# Altium schematic sheet LCD Cape.SchDoc
size A4
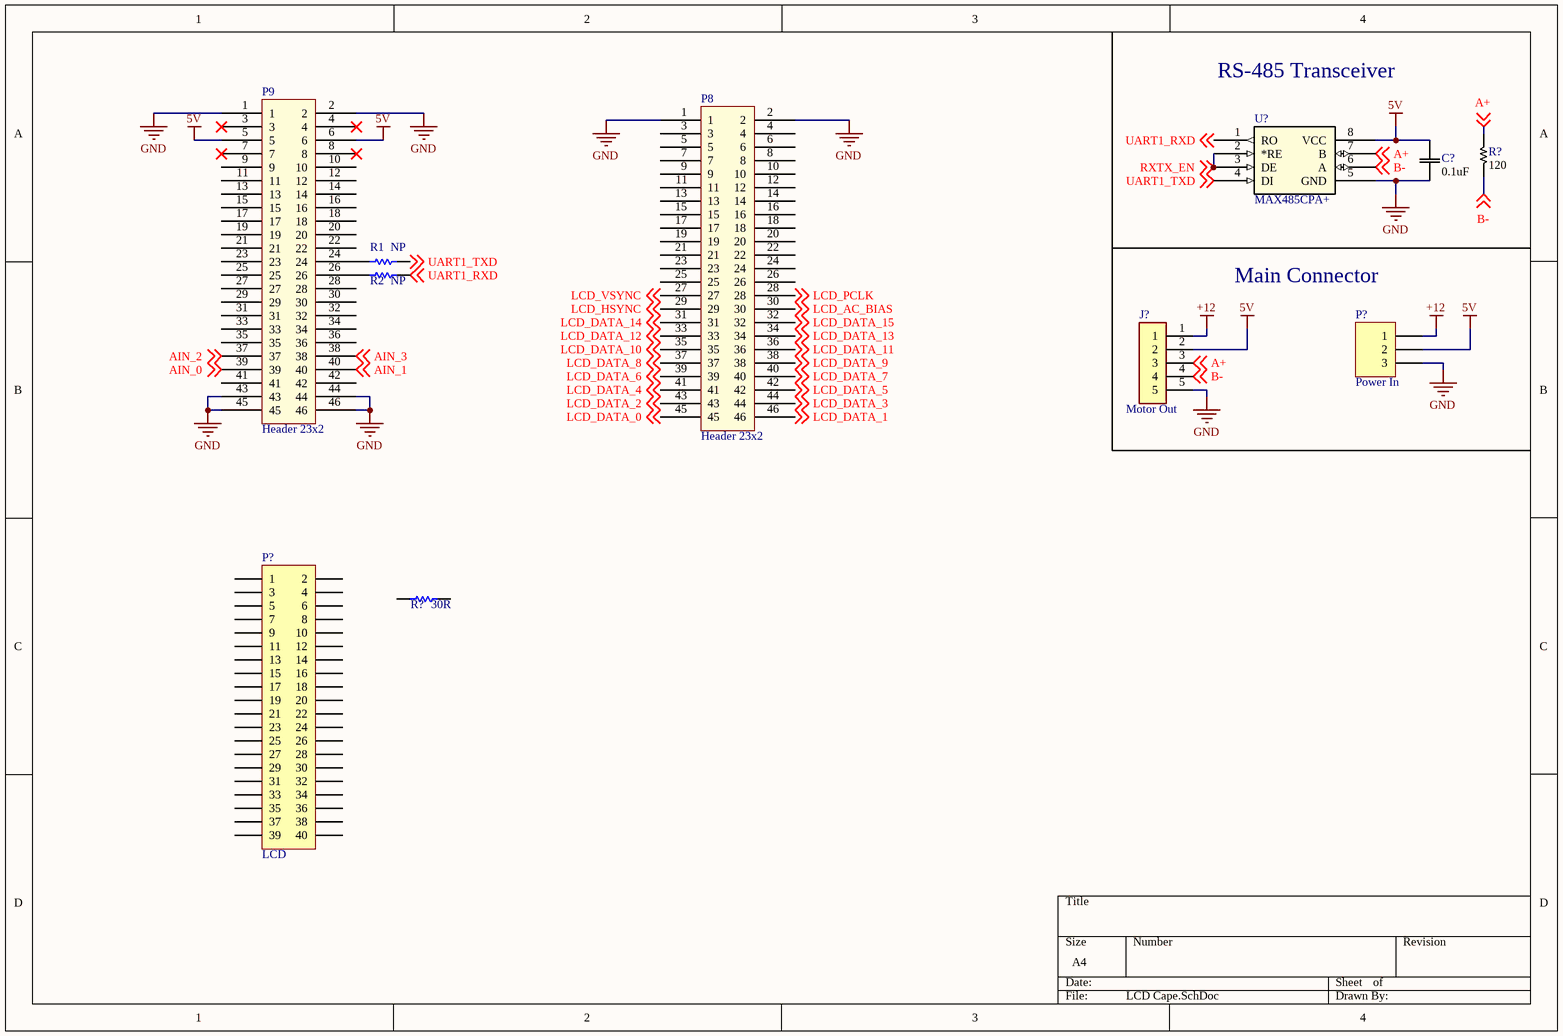
[diagram p0: LCD Cape.SchDoc]

## Parts
(Parts that share a designator on the sheet are numbered #1, #2 ... from top to bottom, then left to right.)
C?  value 0.1uF  [0603]  (hidden comment: Capacitor 1206)
J?  Motor Out  [JST 5POS 2.5mm 90°]
P8  Header 23x2
P9  Header 23x2
P?#1  Power In  [HDR1X3]
P?#2  LCD  [HDR2X20]
R1  value NP  [AXIAL-0.3]  (hidden comment: Res1)
R2  value NP  [AXIAL-0.3]  (hidden comment: Res1)
R?#1  value 120  [0603]  (hidden comment: Resistor 0603)
R?#2  value 30R  [C1206]  (hidden comment: Res1)
U?  MAX485CPA+  [DIP 8 - 3D]

## Nets
5V: C?.2 J?.2 P9.5 P9.6 P?#1.2 U?.8(VCC)
+12: J?.1 P?#1.1
GND: C?.1 J?.5 P8.1 P8.2 P9.1 P9.2 P9.43 P9.44 P9.45 P9.46 P?#1.3 U?.5(GND)
A+: J?.3 R?#1.2 U?.7(B) ; off-sheet A+
AIN_0: P9.39 ; off-sheet AIN_0
AIN_1: P9.40 ; off-sheet AIN_1
AIN_2: P9.37 ; off-sheet AIN_2
AIN_3: P9.38 ; off-sheet AIN_3
B-: J?.4 R?#1.1 U?.6(A) ; off-sheet B-
LCD_AC_BIAS: P8.30 ; off-sheet LCD_AC_BIAS
LCD_DATA_0: P8.45 ; off-sheet LCD_DATA_0
LCD_DATA_1: P8.46 ; off-sheet LCD_DATA_1
LCD_DATA_2: P8.43 ; off-sheet LCD_DATA_2
LCD_DATA_3: P8.44 ; off-sheet LCD_DATA_3
LCD_DATA_4: P8.41 ; off-sheet LCD_DATA_4
LCD_DATA_5: P8.42 ; off-sheet LCD_DATA_5
LCD_DATA_6: P8.39 ; off-sheet LCD_DATA_6
LCD_DATA_7: P8.40 ; off-sheet LCD_DATA_7
LCD_DATA_8: P8.37 ; off-sheet LCD_DATA_8
LCD_DATA_9: P8.38 ; off-sheet LCD_DATA_9
LCD_DATA_10: P8.35 ; off-sheet LCD_DATA_10
LCD_DATA_11: P8.36 ; off-sheet LCD_DATA_11
LCD_DATA_12: P8.33 ; off-sheet LCD_DATA_12
LCD_DATA_13: P8.34 ; off-sheet LCD_DATA_13
LCD_DATA_14: P8.31 ; off-sheet LCD_DATA_14
LCD_DATA_15: P8.32 ; off-sheet LCD_DATA_15
LCD_HSYNC: P8.29 ; off-sheet LCD_HSYNC
LCD_PCLK: P8.28 ; off-sheet LCD_PCLK
LCD_VSYNC: P8.27 ; off-sheet LCD_VSYNC
RXTX_EN: U?.2(*RE) U?.3(DE) ; off-sheet RXTX_EN
UART1_RXD: R2.2 U?.1(RO) ; off-sheet UART1_RXD
UART1_TXD: R1.2 U?.4(DI) ; off-sheet UART1_TXD
NetP9_24: P9.24 R1.1
NetP9_26: P9.26 R2.1

Not connected (* = marked no-connect by the designer): P8 3 4 5 6 7 8 9 10 11 12 13 14 15 16 17 18 19 20 21 22 23 24 25 26; P9 3* 4* 7* 8* 9 10 11 12 13 14 15 16 17 18 19 20 21 22 23 25 27 28 29 30 31 32 33 34 35 36 41 42; P?#2 1 2 3 4 5 6 7 8 9 10 11 12 13 14 15 16 17 18 19 20 21 22 23 24 25 26 27 28 29 30 31 32 33 34 35 36 37 38 39 40; R?#2 1 2

## Notes on the sheet
- RS-485 Transceiver
- (near P?#1) Main Connector

## Library data of the parts
C? = Capacitor 1206: Capacitor SMD 1206; Manufacturer_Part_Number: 12065A820JAT2A; Vendor: AVX Corporation; Built_By: EMA_UL_Team; Type: DEV; Copyright: Copyright (C) 2018 Accelerated Designs. All rights reserved; RefDes: RefDes
J? = JST 5POS: Connector; Manufacturer_Name: JST (JAPAN SOLDERLESS TERMINALS); Manufacturer_Part_Number: S5B-XH-A-1(LF)(SN); Datasheet Link: http://www.jst-mfg.com/product/pdf/eng/eXH.pdf; Height: 6.1mm
P?#1 = Header 3: Header, 3-Pin; LatestRevisionDate: 17-Jul-2002; LatestRevisionNote: Re-released for DXP Platform.; Publisher: Altium Limited
P?#2 = Header 20X2: Header, 20-Pin, Dual row; LatestRevisionDate: 17-Jul-2002; LatestRevisionNote: Re-released for DXP Platform.; Publisher: Altium Limited
R1 R2 R?#2 = Res1: Resistor; Published: 8-Jun-2000; LatestRevisionDate: 17-Jul-2002; LatestRevisionNote: Re-released for DXP Platform.; PackageReference: AXIAL-0.3; Publisher: Altium Limited; PackageDescription: Axial Device, Thru-Hole; 2 Leads; 0.3 in Pin Spacing
R?#1 = Resistor 1206: Resistor 0603 SMD; Manufacturer_Part_Number: ERJ8CWFR024V; Vendor: Panasonic; Built_By: EMA_Cory; Copyright: Copyright (C) 2018 Accelerated Designs. All rights reserved; RefDes: RefDes; Type: DEV
U? = MAX485CPA+: RS485 Communication; Vendor: Maxim Integrated Products; Built_By: EMA_UL_Team; Manufacturer_Part_Number: MAX485CPA+; Copyright: Copyright (C) 2018 Accelerated Designs. All rights reserved; RefDes: RefDes; Type: DEV; Value: Value